# Altium project Macro_Keyboard.PrjPcb
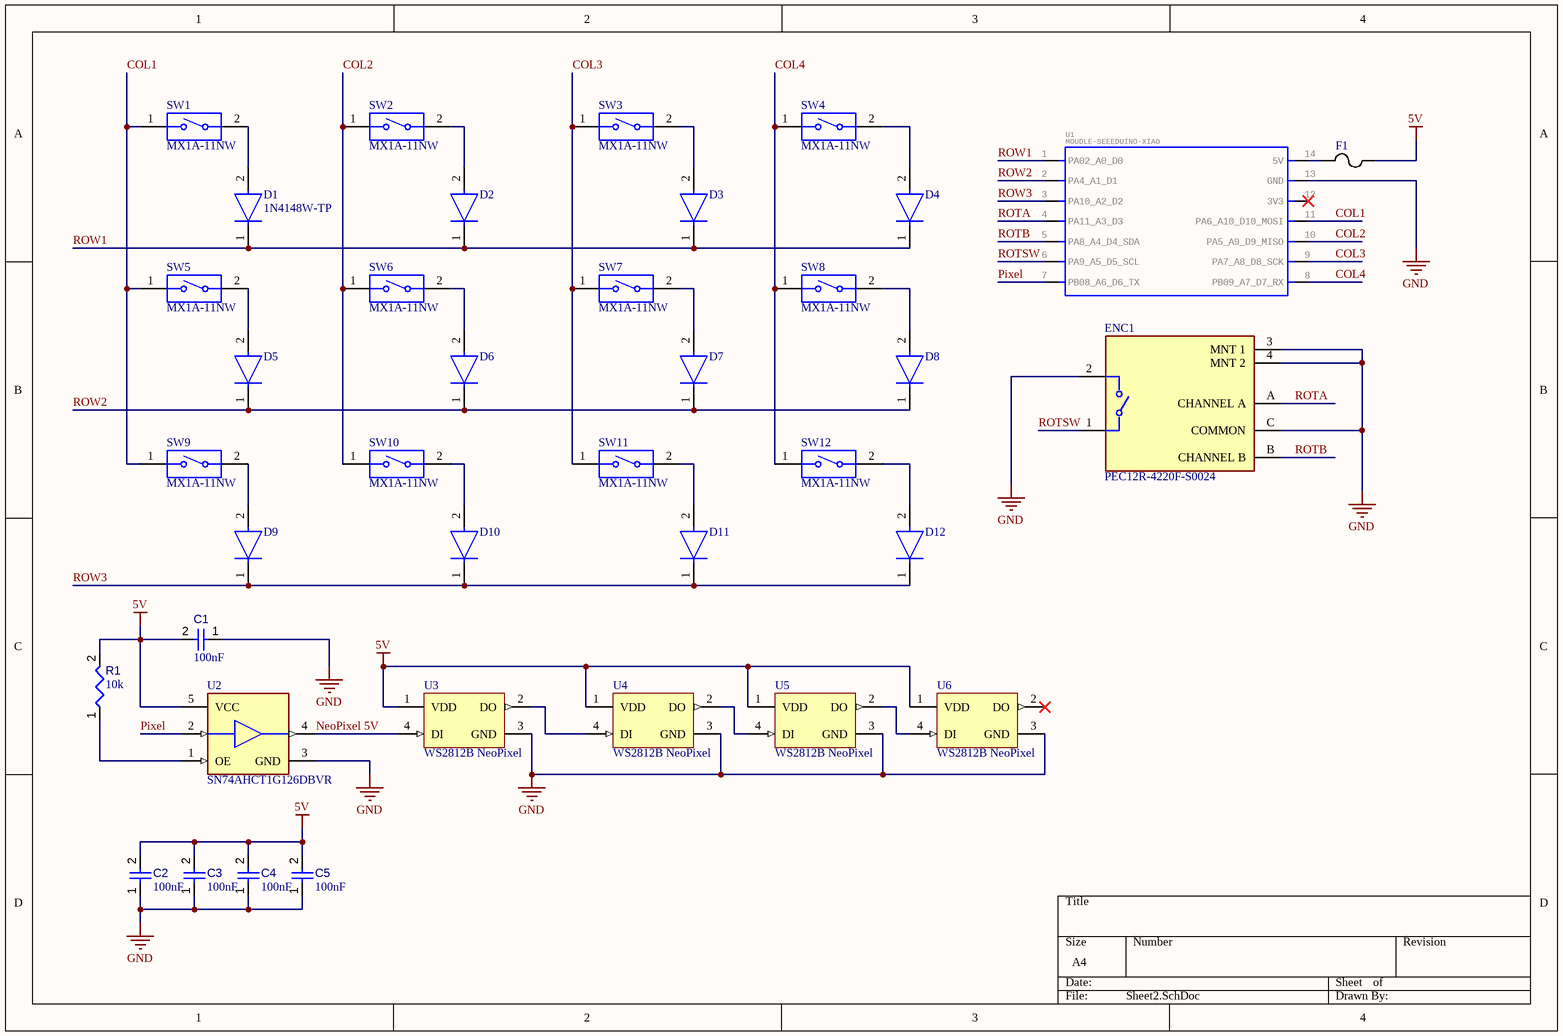
[diagram p0: Sheet2.SchDoc]
CAGE_CODE: ?????; CONTRACT_NUMBER: <CONTRACT NO>; DOC_NO_ASSY_DWG: <ASSY DWG NO>; DOC_NO_BOM: <BOM DOC NO>; DOC_NO_FAB_DWG: <FAB DWG NO>; DOC_NO_SCH_DWG: <SCH DWG NO>; PCB_2_DEC_TOL: +/-.01; PCB_3_DEC_TOL: +/-.010; PCB_ANG_TOL: +/-1/2; PCB_ASSEMBLY_NO: <PCB ASSY NO>; PCB_CHECKER: - -----; PCB_CHECKER_APP_DATE: --/--/----; PCB_DESIGNER: - -----; PCB_DESIGNER_APP_DATE: --/--/----; PCB_DWG_NO: <PCB DWG NO>; PCB_ENGINEER: - -----; PCB_ENGINEER_APP_DATE: --/--/----; PCB_PART_NUMBER: <PCB PN>; PCB_REV: A; SCH_REV: A
1 sheet, 38 parts. Net scope: global (net labels, ports and power ports of the same name join across sheets).
Board file: PCB.PcbDoc

## Sheet Sheet2.SchDoc
size A4; SheetNumber: 1; SheetTotal: 1

### Parts
C1  value 100nF  [CAPC1608X90X40NL10T20]  (hidden comment: Capacitor 100 nF +/-10% 50 V 0603)
C2  value 100nF  [CAPC1608X90X40NL10T20]  (hidden comment: Capacitor 100 nF +/-10% 50 V 0603)
C3  value 100nF  [CAPC1608X90X40NL10T20]  (hidden comment: Capacitor 100 nF +/-10% 50 V 0603)
C4  value 100nF  [CAPC1608X90X40NL10T20]  (hidden comment: Capacitor 100 nF +/-10% 50 V 0603)
C5  value 100nF  [CAPC1608X90X40NL10T20]  (hidden comment: Capacitor 100 nF +/-10% 50 V 0603)
D1  1N4148W-TP  [FP-SOD-123-IPC_A]
D2  1N4148W-TP  [FP-SOD-123-IPC_A]  (value not drawn)
D3  1N4148W-TP  [FP-SOD-123-IPC_A]  (value not drawn)
D4  1N4148W-TP  [FP-SOD-123-IPC_A]  (value not drawn)
D5  1N4148W-TP  [FP-SOD-123-IPC_A]  (value not drawn)
D6  1N4148W-TP  [FP-SOD-123-IPC_A]  (value not drawn)
D7  1N4148W-TP  [FP-SOD-123-IPC_A]  (value not drawn)
D8  1N4148W-TP  [FP-SOD-123-IPC_A]  (value not drawn)
D9  1N4148W-TP  [FP-SOD-123-IPC_A]  (value not drawn)
D10  1N4148W-TP  [FP-SOD-123-IPC_A]  (value not drawn)
D11  1N4148W-TP  [FP-SOD-123-IPC_A]  (value not drawn)
D12  1N4148W-TP  [FP-SOD-123-IPC_A]  (value not drawn)
ENC1  PEC12R-4220F-S0024  [FP-PEC12R-4220F-S0024-MFG]
F1  0ZCK0050FF2E  [0ZCK_BEL]  (value not drawn)
R1  value 10k  [RESC2013X50X35ML15T15]  (hidden comment: Resistor 10k +/-1% 0805 125 mW)
SW1  MX1A-11NW  [CHRY-MX1A-11NW_V]
SW2  MX1A-11NW  [CHRY-MX1A-11NW_V]
SW3  MX1A-11NW  [CHRY-MX1A-11NW_V]
SW4  MX1A-11NW  [CHRY-MX1A-11NW_V]
SW5  MX1A-11NW  [CHRY-MX1A-11NW_V]
SW6  MX1A-11NW  [CHRY-MX1A-11NW_V]
SW7  MX1A-11NW  [CHRY-MX1A-11NW_V]
SW8  MX1A-11NW  [CHRY-MX1A-11NW_V]
SW9  MX1A-11NW  [CHRY-MX1A-11NW_V]
SW10  MX1A-11NW  [CHRY-MX1A-11NW_V]
SW11  MX1A-11NW  [CHRY-MX1A-11NW_V]
SW12  MX1A-11NW  [CHRY-MX1A-11NW_V]
U1  MOUDLE-SEEEDUINO-XIAO  [MOUDLE14P-2-54-21X17-8MM]
U2  SN74AHCT1G126DBVR  [FP-DBV0005A-IPC_C]
U3  WS2812B NeoPixel  [ADA-RGB-1655_V]
U4  WS2812B NeoPixel  [ADA-RGB-1655_V]
U5  WS2812B NeoPixel  [ADA-RGB-1655_V]
U6  WS2812B NeoPixel  [ADA-RGB-1655_V]

### Nets
5V: C1.2 C2.2 C3.2 C4.2 C5.2 F1.2 R1.2 U2.5(VCC) U3.1(VDD) U4.1(VDD) U5.1(VDD) U6.1(VDD)
GND: C1.1 C2.1 C3.1 C4.1 C5.1 ENC1.2 ENC1.3(MNT_1) ENC1.4(MNT_2) ENC1.C(COMMON) U1.13(GND) U2.3(GND) U3.3(GND) U4.3(GND) U5.3(GND) U6.3(GND)
COL1: SW1.1 SW5.1 SW9.1 U1.11(PA6_A10_D10_MOSI)
COL2: SW2.1 SW6.1 SW10.1 U1.10(PA5_A9_D9_MISO)
COL3: SW3.1 SW7.1 SW11.1 U1.9(PA7_A8_D8_SCK)
COL4: SW4.1 SW8.1 SW12.1 U1.8(PB09_A7_D7_RX)
NeoPixel 5V: U2.4(Y) U3.4(DI)
Pixel: U1.7(PB08_A6_D6_TX) U2.2(A)
ROTA: ENC1.A(CHANNEL_A) U1.4(PA11_A3_D3)
ROTB: ENC1.B(CHANNEL_B) U1.5(PA8_A4_D4_SDA)
ROTSW: ENC1.1 U1.6(PA9_A5_D5_SCL)
ROW1: D1.1(C) D2.1(C) D3.1(C) D4.1(C) U1.1(PA02_A0_D0)
ROW2: D5.1(C) D6.1(C) D7.1(C) D8.1(C) U1.2(PA4_A1_D1)
ROW3: D9.1(C) D10.1(C) D11.1(C) D12.1(C) U1.3(PA10_A2_D2)
NetD1_2: D1.2(A) SW1.2
NetD2_2: D2.2(A) SW2.2
NetD3_2: D3.2(A) SW3.2
NetD4_2: D4.2(A) SW4.2
NetD5_2: D5.2(A) SW5.2
NetD6_2: D6.2(A) SW6.2
NetD7_2: D7.2(A) SW7.2
NetD8_2: D8.2(A) SW8.2
NetD9_2: D9.2(A) SW9.2
NetD10_2: D10.2(A) SW10.2
NetD11_2: D11.2(A) SW11.2
NetD12_2: D12.2(A) SW12.2
NetF1_1: F1.1 U1.14(5V)
NetR1_1: R1.1 U2.1(OE)
NetU3_2: U3.2(DO) U4.4(DI)
NetU4_2: U4.2(DO) U5.4(DI)
NetU5_2: U5.2(DO) U6.4(DI)

Not connected (* = marked no-connect by the designer): U1 12(3V3)*; U6 2(DO)*

### Library data of the parts
C1-C5 = CMP-001-00017-6: Chip Capacitor, 100 nF, +/- 10%, 50 V, 0603 (1608 Metric); Voltage Rating: 50V; Capacitor Type: Ceramic; Tolerance: 10%; Mounting Technology: SM; Max Operating Temperature: 125°C; RoHS Compliant: True; Pins: 2; Case/Package: 0603; Min Operating Temperature: -55°C
D1-D12 = CMP-2000-04993-2: DIODE GEN PURP 100V 150MA SOD123; Max Reverse Leakage Current: 5uA; Max Surge Current: 2A; Reverse Recovery Time: 4ns; Polarity: Standard; Capacitance: 4pF; Max Forward Surge Current (Ifsm): 1A; Element Configuration: Single; Power Dissipation: 400mW; Forward Voltage: 1V; Radiation Hardening: No; Lead Free: Lead Free; Max Reverse Voltage (DC): 100V; Current Rating: 150mA; Forward Current: 150mA; Packaging: Tape and Reel; Number of Pins: 2; Package Quantity: 3000; Max Operating Temperature: 150°C; Min Operating Temperature: -65°C; Average Rectified Current: 150mA; Recovery Time: 4ns; Output Current: 150mA; Peak Non-Repetitive Surge Current: 2A; Width: 1.8mm; Voltage Rating (DC): 100V; Height: 1.2mm; Max Repetitive Reverse Voltage (Vrrm): 100V; Mount: Surface Mount; Length: 2.85mm
ENC1 = CMP-07421-000021-1: ROTARY ENCODER MECHANICAL 24PPR; Built in Switch: Yes; Pulses per Revolution: 24; Output Type: Quadrature; Hole Diameter: 2mm; Number of Channels: 2; Max Supply Voltage (DC): 5V; RoHS Compliant: Yes; Max Operating Temperature: 70°C; Length: 26mm; Width: 12.5mm; Encoder Type: Mechanical; Series: PEC12R; Mount: Through Hole; Height: 13.4mm; Packaging: Bulk; Package Quantity: 150; Termination: PC Pin; Min Operating Temperature: -30°C; REACH SVHC: No SVHC; Detent: Yes; Orientation: Vertical
F1 = 0ZCK0050FF2E: No Description Available; Mfr_Name: Belfuse
R1 = CMP-009-00018-5: Chip Resistor, 10 KOhm, +/- 1%, 125 mW, -55 to 155 degC, 0805 (2012 Metric); Power: 125mW; Voltage Rating: 150V; Tolerance: 1%; Pins: 2; Min Operating Temperature: -55°C; Case/Package: 0805; Max Operating Temperature: 155°C; RoHS Compliant: True; Mounting Technology: SM
SW1-SW12 = CMP-00028-00007-1: Keypad Switch, 1 Switches, SPST, Momentary, 0.01A, 12VDC, 0.78N, Solder Terminal, Through Hole-straight; Mounting Technology: Through Hole; Min Operating Temperature: -10°C; Max Operating Temperature: 70°C; RoHS Compliant: Yes
U1 = MOUDLE-SEEEDUINO-XIAO: GateName_1: G$1; SymbolName_1: MOUDLE-SEEEDUINO-XIAO; LibraryName: Seeeduino-XIAO-footprint-eagle; DeviceSetName: MOUDLE-SEEEDUINO-XIAO; Package: MOUDLE14P-2.54-21X17.8MM
U2 = CMP-0859-00077-4: IC BUF NON-INVERT 5.5V SOT23-5; Polarity: Non-Inverting; Number of Output Lines: 1; Quiescent Current: 1uA; Propagation Delay: 7.5ns; Output Type: 3-STATE; Min Supply Voltage: 4.5V; Turn-On Delay Time: 10ns; Nominal Supply Current: 250mA; Operating Supply Voltage: 5V; Logic Function: Buffer; Low Level Output Current: 8mA; High Level Output Current: -8mA; Package Quantity: 3000; Max Operating Temperature: 125°C; Number of Input Lines: 1; Contact Plating: Tin; Series: 74AHCT; Mount: Surface Mount; Number of Pins: 5; Radiation Hardening: No; Case/Package: SOT-23; Packaging: Tape and Reel; Lead Free: Lead Free; Max Supply Voltage: 5.5V; Number of Inputs: 1; RoHS Compliant: Yes; Number of Gates: 1; Number of Bits per Element: 1; Min Operating Temperature: -40°C; Number of Outputs: 1; Number of Channels: 1; Number of Circuits: 1; Number of Bits: 1; Technology: CMOS; Number of Elements: 1; REACH SVHC: No SVHC
U3-U6 = CMP-007-00037-1: WS2812B 5050 RGB LED WITH INTEGRATED DRIVER CHIP PACK OF 10